# EAGLE design display_device_for_board (EAGLE 8.3.2)
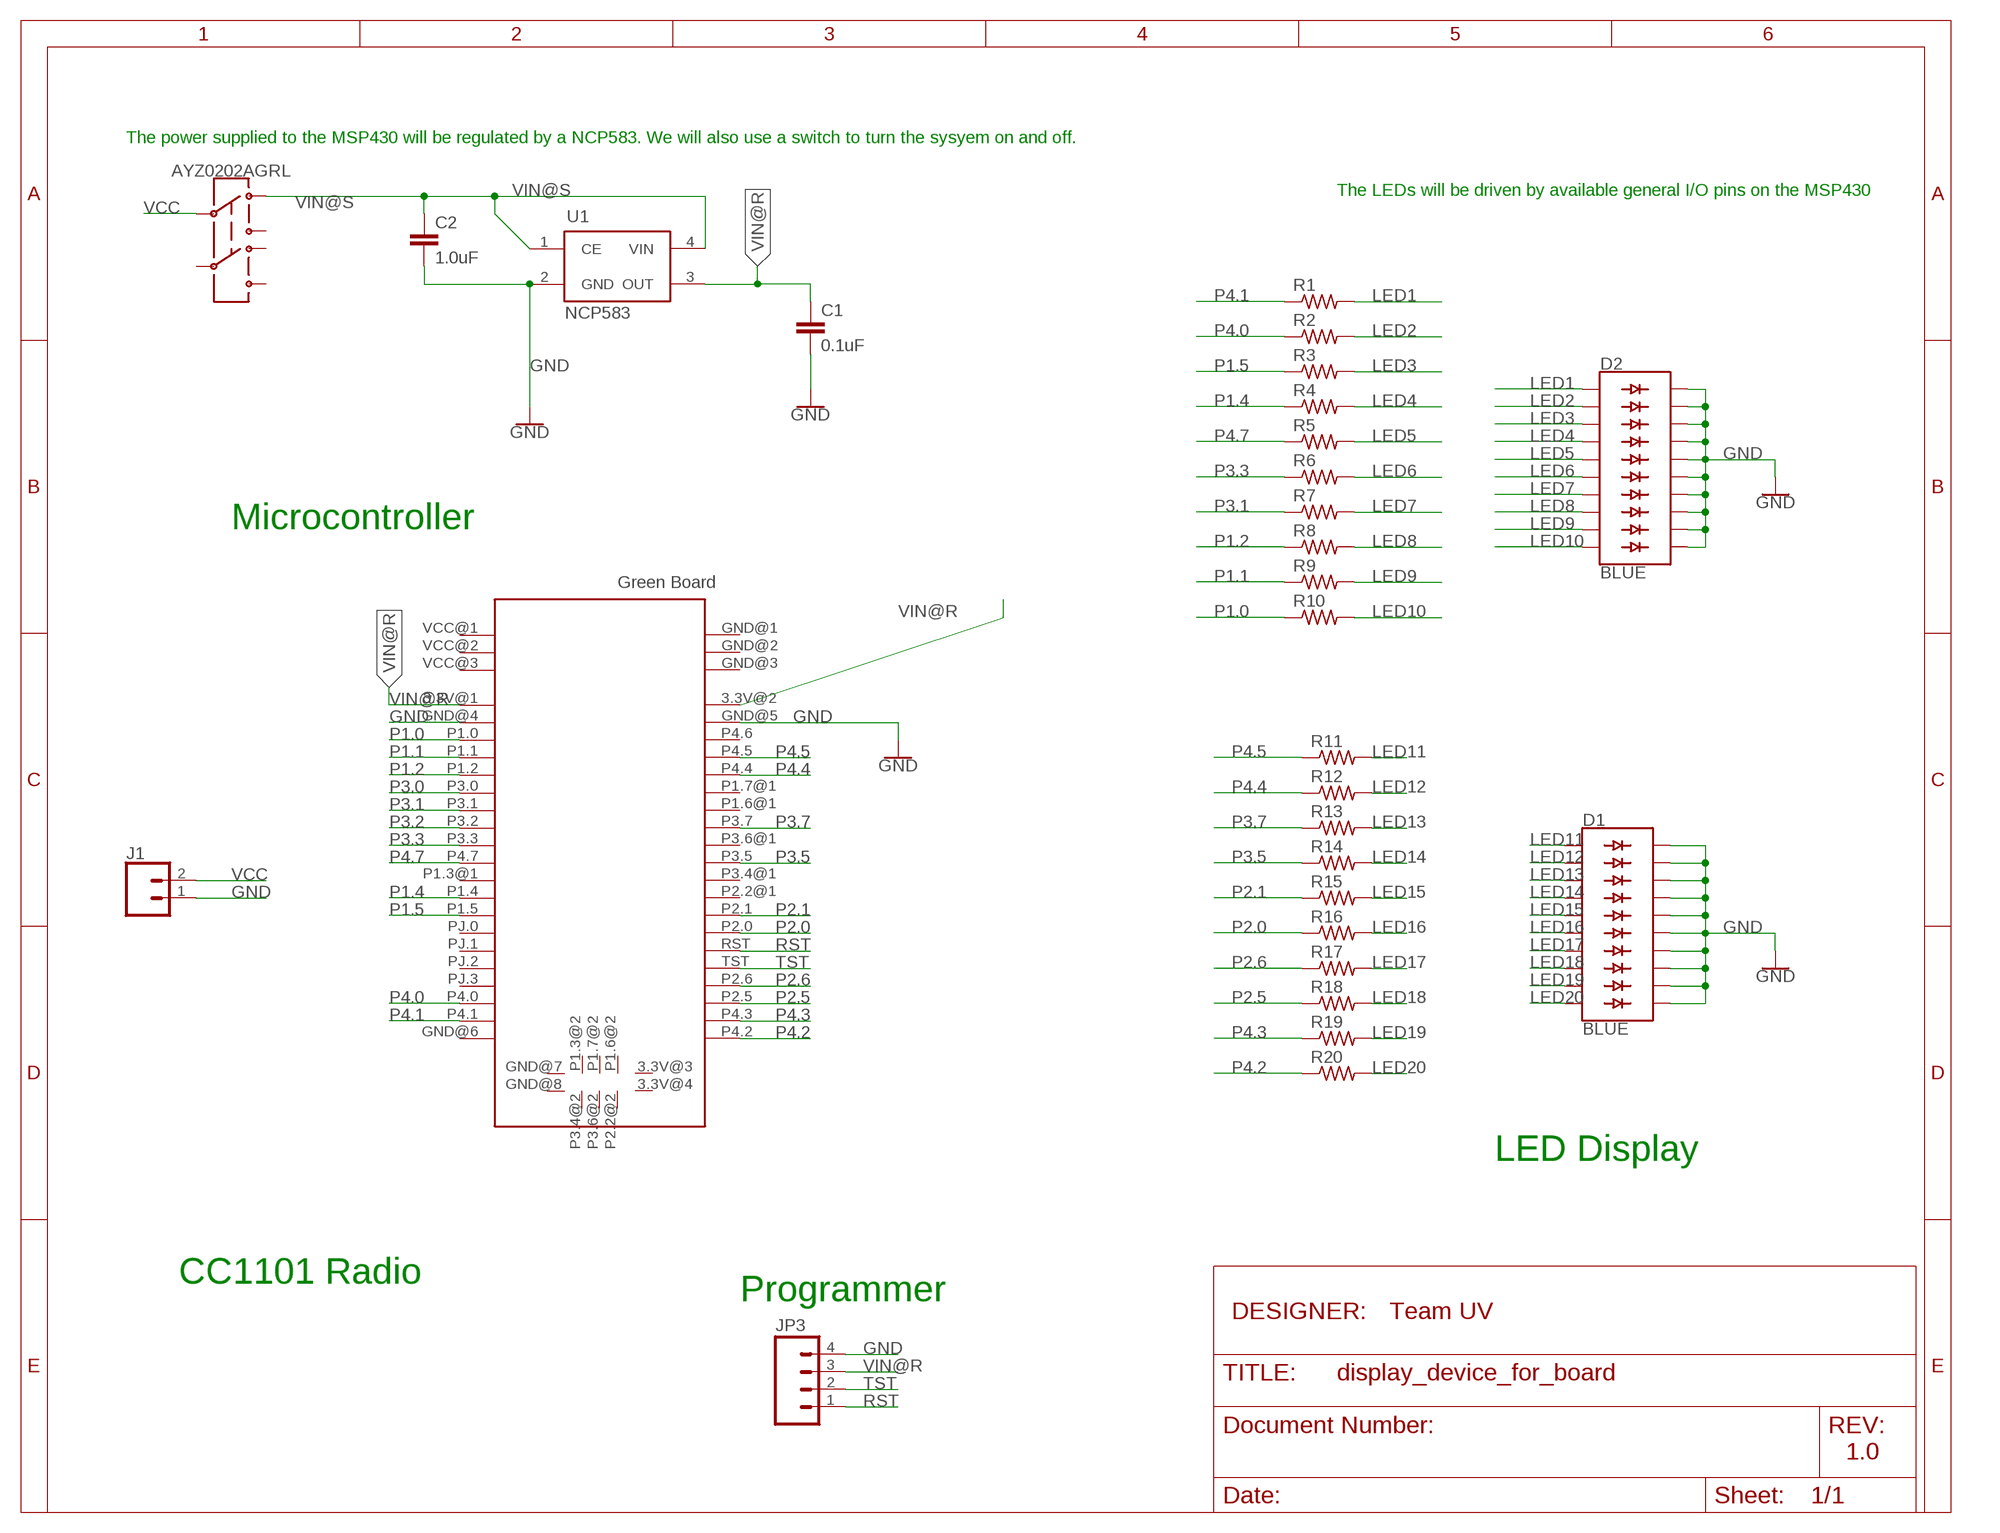
[diagram p0: schematic, sheet 1]

## Parts
AYZ0202AGRL  SWITCH-DPDT-SMD-AYZ0202  [SWITCH_DPDT_SMD_AYZ0202]
C1  0.1uF  1.0UF-0805-25V-(+80/-20%)  [0805]
C2  1.0uF  1.0UF-0805-25V-(+80/-20%)  [0805]
D1  BLUE  LED_BARGRAPH_10BLUE  [LED_BARGRAPH_10]
D2  BLUE  LED_BARGRAPH_10BLUE  [LED_BARGRAPH_10]
J1  CONN_02  [1X02]
JP3  M04PTH  [1X04]
R1  R-US_R0805  [R0805]
R2  R-US_R0805  [R0805]
R3  R-US_R0805  [R0805]
R4  R-US_R0805  [R0805]
R5  R-US_R0805  [R0805]
R6  R-US_R0805  [R0805]
R7  R-US_R0805  [R0805]
R8  R-US_R0805  [R0805]
R9  R-US_R0805  [R0805]
R10  R-US_R0805  [R0805]
R11  R-US_R0805  [R0805]
R12  R-US_R0805  [R0805]
R13  R-US_R0805  [R0805]
R14  R-US_R0805  [R0805]
R15  R-US_R0805  [R0805]
R16  R-US_R0805  [R0805]
R17  R-US_R0805  [R0805]
R18  R-US_R0805  [R0805]
R19  R-US_R0805  [R0805]
R20  R-US_R0805  [R0805]
U1  NCP583  [SC82-AB_1PRIMARY]
U$1  GREEDNBRD  [GREENBRD]

## Nets
GND: C1.2 C2.2 D1.11(C9) D1.12(C8) D1.13(C7) D1.14(C6) D1.15(C5) D1.16(C4) D1.17(C3) D1.18(C2) D1.19(C1) D1.20(C) D2.11(C9) D2.12(C8) D2.13(C7) D2.14(C6) D2.15(C5) D2.16(C4) D2.17(C3) D2.18(C2) D2.19(C1) D2.20(C) J1.1 JP3.4 U1.2(GND) U$1.GND@4(GND) U$1.GND@5(GND)
LED1: D2.1(A) R1.2
LED2: D2.2(A1) R2.2
LED3: D2.3(A2) R3.2
LED4: D2.4(A3) R4.2
LED5: D2.5(A4) R5.2
LED6: D2.6(A5) R6.2
LED7: D2.7(A6) R7.2
LED8: D2.8(A7) R8.2
LED9: D2.9(A8) R9.2
LED10: D2.10(A9) R10.2
LED11: D1.1(A) R11.2
LED12: D1.2(A1) R12.2
LED13: D1.3(A2) R13.2
LED14: D1.4(A3) R14.2
LED15: D1.5(A4) R15.2
LED16: D1.6(A5) R16.2
LED17: D1.7(A6) R17.2
LED18: D1.8(A7) R18.2
LED19: D1.9(A8) R19.2
LED20: D1.10(A9) R20.2
P1.0: R10.1 U$1.P1.0
P1.1: R9.1 U$1.P1.1
P1.2: R8.1 U$1.P1.2
P1.4: R4.1 U$1.P1.4
P1.5: R3.1 U$1.P1.5
P2.0: R16.1 U$1.P2.0
P2.1: R15.1 U$1.P2.1
P2.5: R18.1 U$1.P2.5
P2.6: R17.1 U$1.P2.6
P3.0: U$1.P3.0
P3.1: R7.1 U$1.P3.1
P3.2: U$1.P3.2
P3.3: R6.1 U$1.P3.3
P3.5: R14.1 U$1.P3.5
P3.7: R13.1 U$1.P3.7
P4.0: R2.1 U$1.P4.0
P4.1: R1.1 U$1.P4.1
P4.2: R20.1 U$1.P4.2
P4.3: R19.1 U$1.P4.3
P4.4: R12.1 U$1.P4.4
P4.5: R11.1 U$1.P4.5
P4.7: R5.1 U$1.P4.7
RST: JP3.1 U$1.RST
TST: JP3.2 U$1.TST
VCC: AYZ0202AGRL.2 J1.2
VIN@R: C1.1 JP3.3 U1.3(OUT) U$1.3.3V@1(3.3V) U$1.3.3V@2(3.3V)
VIN@S: AYZ0202AGRL.1 C2.1 U1.1(CE) U1.4(VIN)
Unconnected: AYZ0202AGRL.3 AYZ0202AGRL.4 AYZ0202AGRL.5 AYZ0202AGRL.6 U$1.3.3V@3(3.3V) U$1.3.3V@4(3.3V) U$1.GND@1(GND) U$1.GND@2(GND) U$1.GND@3(GND) U$1.GND@6(GND) U$1.GND@7(GND) U$1.GND@8(GND) U$1.P1.3@1(P1.3) U$1.P1.3@2(P1.3) U$1.P1.6@1(P1.6) U$1.P1.6@2(P1.6) U$1.P1.7@1(P1.7) U$1.P1.7@2(P1.7) U$1.P2.2@1(P2.2) U$1.P2.2@2(P2.2) U$1.P3.4@1(P3.4) U$1.P3.4@2(P3.4) U$1.P3.6@1(P3.6) U$1.P3.6@2(P3.6) U$1.P4.6 U$1.PJ.0 U$1.PJ.1 U$1.PJ.2 U$1.PJ.3 U$1.VCC@1(VCC) U$1.VCC@2(VCC) U$1.VCC@3(VCC)

## Notes on the sheet
- The power supplied to the MSP430 will be regulated by a NCP583. We will also use a switch to turn the sysyem on and off.
- The LEDs will be driven by available general I/O pins on the MSP430
- Microcontroller
- LED Display
- CC1101 Radio
- Programmer
- DESIGNER: | Team UV
- 1.0

## Library data of the parts
AYZ0202AGRL = SparkFun-Switches:SWITCH-DPDT: Double-Pole, Double-Throw (DPDT) Switch Double-pole, double-throw switches. Variant Overview PTH-GPI-152-3013 Used on SparkFun Geiger Counter <https://www.sparkfun.com/products/11345> SMD-AY0202 Surface Mount DPDT Switch <https://www.sparkfun.com/products/597> (COM-00597) Used on e.g. LilyPad Arduino USB - ATmega32U4 Board <https://www.sparkfun.com/products/12049>; PROD_ID: SWCH-08179; SF_SKU: COM-00597
C1 = SparkFun-Capacitors:1.0UF: 1µF ceramic capacitors A capacitor is a passive two-terminal electrical component used to store electrical energy temporarily in an electric field.; PROD_ID: CAP-11625; VALUE: 1.0uF
C2 = SparkFun-Capacitors:1.0UF: 1µF ceramic capacitors A capacitor is a passive two-terminal electrical component used to store electrical energy temporarily in an electric field.; PROD_ID: CAP-11625
D1 D2 = SparkFun-LED:LED_BARGRAPH_10: Young Sun LED Tech - YSLB-10251G5-10 10-Segment LED Bar Graph Features: Red Vf = 2.1V, Ifmax = 20mA Yellow Vf = 2.1V, Ifmax = 20mA Blue Vf = 3.4V, Ifmax = 20mA Green Vf = 3.4V, Ifmax = 20mA SparkFun Products: Red <https://www.sparkfun.com/products/9935> Yellow <https://www.sparkfun.com/products/9936> Green <https://www.sparkfun.com/products/9938> Blue <https://www.sparkfun.com/products/9937>; PROD_ID: DIO-10613
J1 = SparkFun-Connectors:CONN_02: Multi connection point. Often used as Generic Header-pin footprint for 0.1 inch spaced/style header connections On any of the 0.1 inch spaced packages, you can populate with these: Break Away Headers - Straight <https://www.sparkfun.com/products/116> (PRT-00116) Break Away Male Headers - Right Angle <https://www.sparkfun.com/products/553> (PRT-00553) Female Headers <https://www.sparkfun.com/products/115> (PRT-00115) Break Away Headers - Machine Pin <https://www.sparkfun.com/products/117> (PRT-00117) Break Away Female Headers - Swiss Machine Pin <https://www.sparkfun.com/products/743> (PRT-00743) For SCREWTERMINALS and SPRING TERMINALS visit here: Screw Terimnals on SparkFun.com <https://www.sparkfun.com/search/results?term=Screw+Terminals> (5mm/3.5mm/2.54mm spacing) This device is also useful as a general connection point to wire up your design to another part of your project. Our various solder wires solder well into these plated through hole pads. Hook-Up Wire - Assortment (Stranded, 22 AWG) <https://www.sparkfun.com/products/11375> (PRT-11375) Hook-Up Wire - Assortment (Solid Core, 22 AWG) <https://www.sparkfun.com/products/11367> (PRT-11367) View the entire wire category on our website here <https://www.sparkfun.com/categories/141> Special notes: Molex polarized connector foot print use with: PRT-08233 with associated crimp pins and housings. 2.54_SCREWTERM for use with PRT-10571. 3.5mm Screw Terminal footprints for PRT-08084 5mm Screw Terminal footprints for use with PRT-08432
JP3 = Moo1.2:M04: Header 4 Standard 4-pin 0.1" header. Use with straight break away headers (SKU : PRT-00116), right angle break away headers (PRT-00553), swiss pins (PRT-00743), machine pins (PRT-00117), and female headers (PRT-00115). Molex polarized connector foot print use with SKU : PRT-08231 with associated crimp pins and housings. 1MM SMD Version SKU: PRT-10208
R1-R20 = rcl:R-US_: RESISTOR, American symbol
U1 = ncp583:NCP583: NCP583 - Ultra-Low Iq 150 mA CMOS LDO Regulator with Enable The NCP583 series of low dropout regulators are designed for portable battery powered applications which require precise output voltage accuracy and low quiescent current. These devices feature an enable function which lowers current consumption significantly and are offered in two small packages; SC−82AB and the SOT−563. A 1.0 mF ceramic capacitor is the recommended value to be used with these devices on the output pin.
U$1 = GreenBoard:GREEDNBRD

## Board
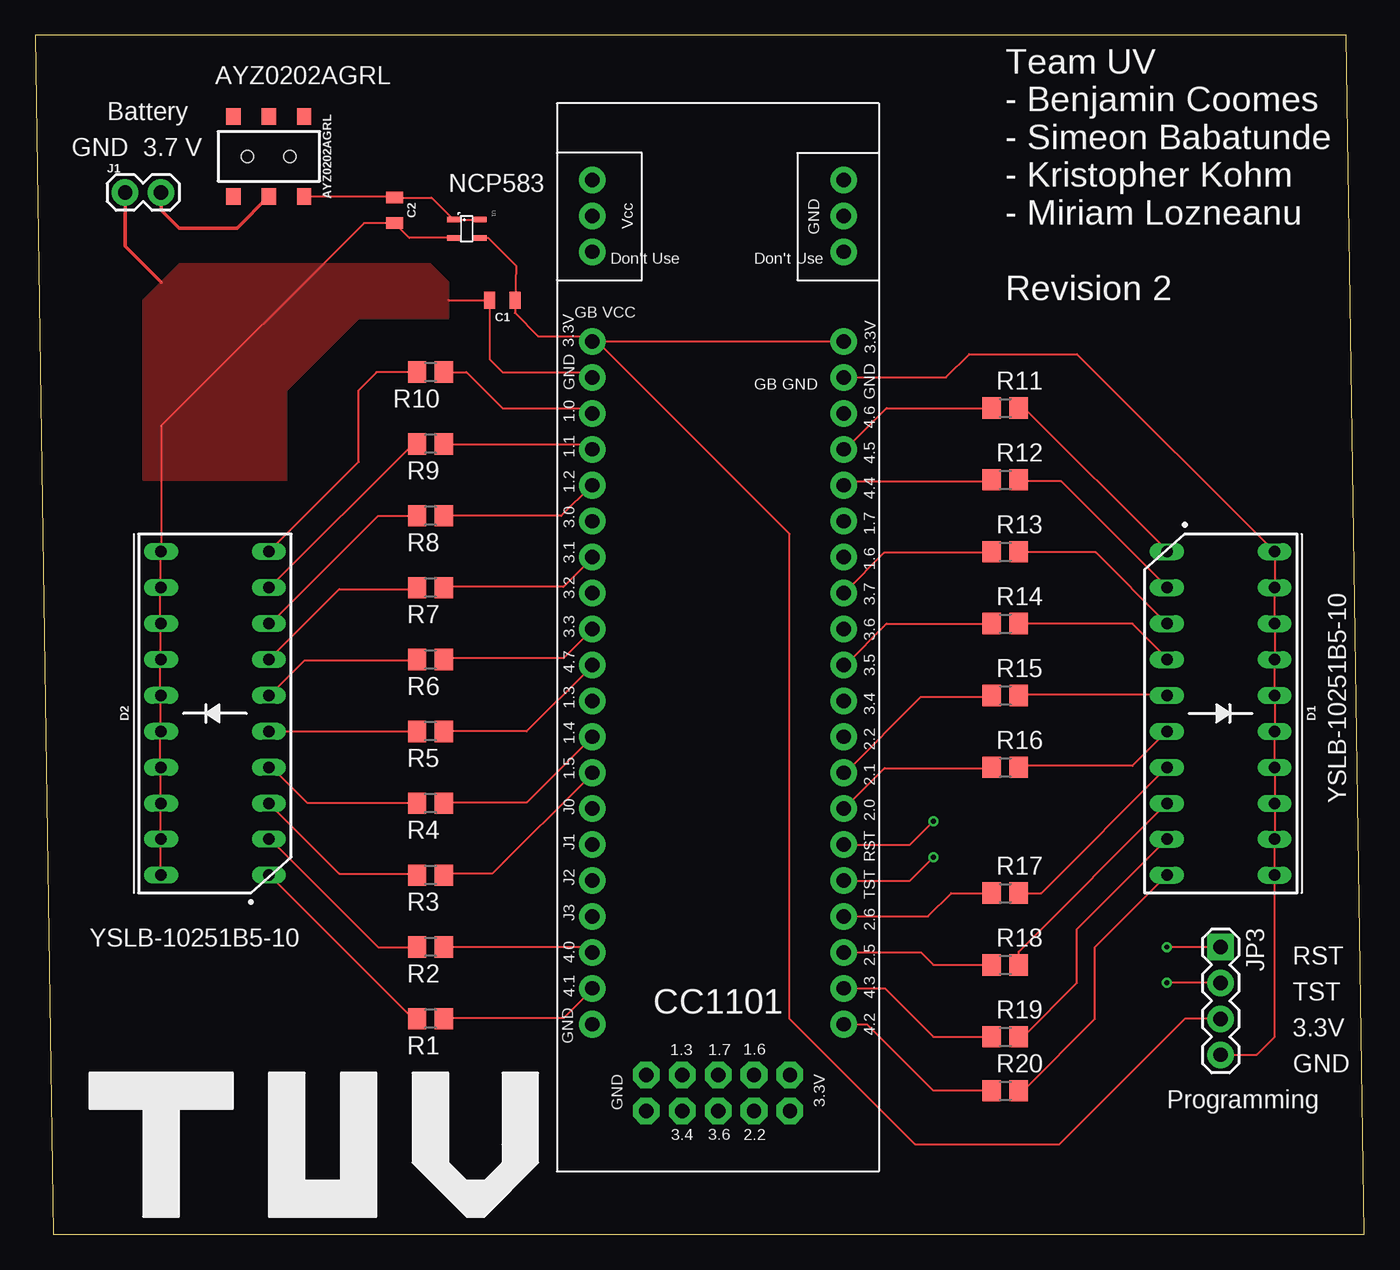
[diagram p1: board, top side]
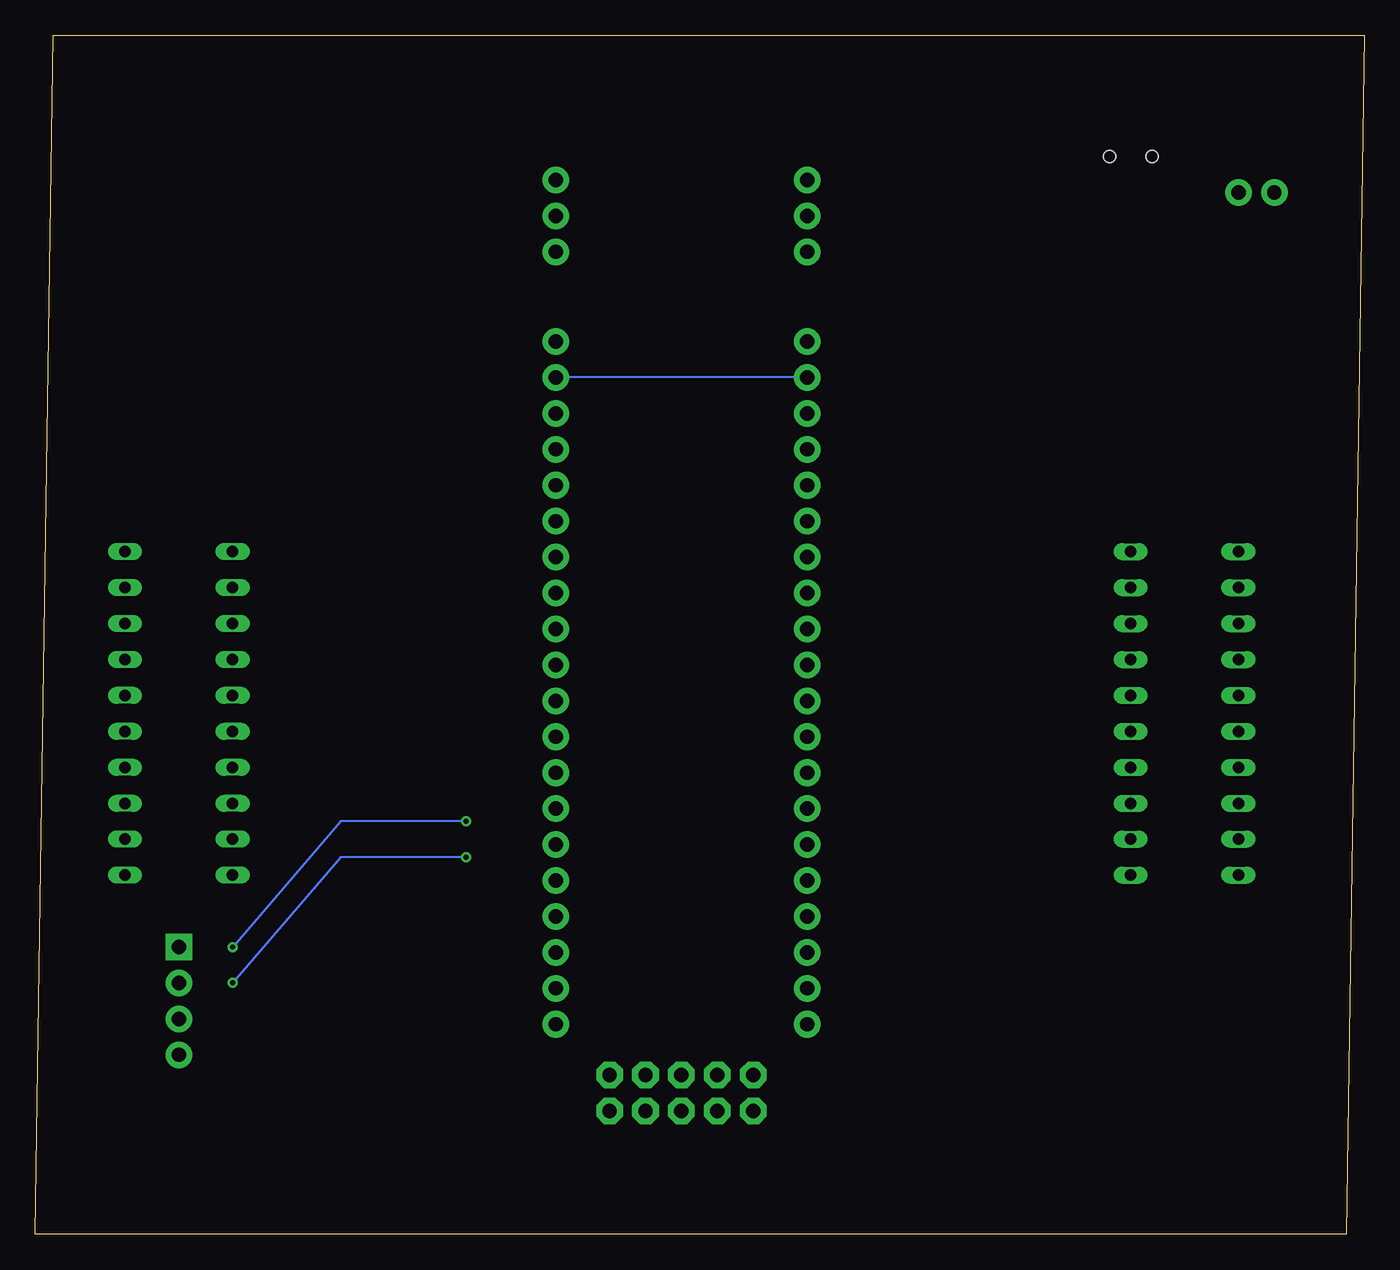
[diagram p2: board, bottom side, seen from below]

Size 93.96 x 84.76 mm. Coordinates in mm from the lower left corner, seen from the top.
Outline: 1.27,0 93.96,0 92.69,84.76 0,84.76 1.27,0
Copper layers (1*16): Top 0.0356mm / dielectric 1.5011mm / Bottom 0.0356mm
Design rules "oshpark-2layer": minimum track width 6mil, minimum drill 13mil, track to track 6mil, track to pad 6mil, pad to pad 6mil, via to via 6mil, smd to smd 6mil, copper to edge 15mil, drill to drill 6mil, minimum pad ring 7mil, minimum via ring 7mil, stop-mask expansion 2.5mil, vias tented up to drill 0mil, thermal gap 10mil

### Footprints (pad centres in the part's own frame; a part is rotated, then mirrored left to right if it is on the bottom)
SWITCH_DPDT_SMD_AYZ0202 = smd 1 x 1.15: 1 -2.5,2.825; 2 0,2.825; 3 2.5,2.825; 4 -2.5,-2.825; 5 0,-2.825; 6 2.5,-2.825 | hole 0.85: 1.5,0; -1.5,0
0805 = smd 0.8 x 1.2: 1 -0.9,0; 2 0.9,0
LED_BARGRAPH_10 = drill 0.813 long: 1 -11.43,-3.81; 2 -8.89,-3.81; 3 -6.35,-3.81; 4 -3.81,-3.81; 5 -1.27,-3.81; 6 1.27,-3.81; 7 3.81,-3.81; 8 6.35,-3.81; 9 8.89,-3.81; 10 11.43,-3.81; 11 11.43,3.81; 12 8.89,3.81; 13 6.35,3.81; 14 3.81,3.81; 15 1.27,3.81; 16 -1.27,3.81; 17 -3.81,3.81; 18 -6.35,3.81; 19 -8.89,3.81; 20 -11.43,3.81
1X02 = drill 1.016 pad 1.88: 1 0,0; 2 2.54,0
1X04 = drill 1.016 pad 1.88 square: 1 0,0 | drill 1.016 pad 1.88: 2 2.54,0; 3 5.08,0; 4 7.62,0
R0805 = smd 1.3 x 1.5: 1 -0.95,0; 2 0.95,0
SC82-AB_1PRIMARY = smd 0.406 x 0.914: 1 -0.621,-0.913; 2 0.675,-0.913; 3 0.675,0.967; 4 -0.621,0.967
GREENBRD = drill 1.015 pad 1.88: 3.3V@1 -8.875,21.21; 3.3V@2 8.905,21.21; GND@1 8.905,32.63; GND@2 8.905,30.09; GND@3 8.905,27.55; GND@4 -8.875,18.67; GND@5 8.905,18.67; GND@6 -8.875,-27.05; P1.0 -8.875,16.13; P1.1 -8.875,13.59; P1.2 -8.875,11.05; P1.3@1 -8.875,-4.19; P1.4 -8.875,-6.73; P1.5 -8.875,-9.27; P1.6@1 8.905,5.97; P1.7@1 8.905,8.51; P2.0 8.905,-11.81; P2.1 8.905,-9.27; P2.2@1 8.905,-6.73; P2.5 8.905,-21.97; P2.6 8.905,-19.43; P3.0 -8.875,8.51; P3.1 -8.875,5.97; P3.2 -8.875,3.43; P3.3 -8.875,0.89; P3.4@1 8.905,-4.19; P3.5 8.905,-1.65; P3.6@1 8.905,0.89; P3.7 8.905,3.43; P4.0 -8.875,-21.97; P4.1 -8.875,-24.51; P4.2 8.905,-27.05; P4.3 8.905,-24.51; P4.4 8.905,11.05; P4.5 8.905,13.59; P4.6 8.905,16.13; P4.7 -8.875,-1.65; PJ.0 -8.875,-11.81; PJ.1 -8.875,-14.35; PJ.2 -8.875,-16.89; PJ.3 -8.875,-19.43; RST 8.905,-14.35; TST 8.905,-16.89; VCC@1 -8.875,32.63; VCC@2 -8.875,30.09; VCC@3 -8.875,27.55 | drill 1.015 pad 1.88 octagon: 3.3V@3 5.095,-30.63; 3.3V@4 5.095,-33.17; GND@7 -5.065,-30.63; GND@8 -5.065,-33.17; P1.3@2 -2.525,-30.63; P1.6@2 2.555,-30.63; P1.7@2 0.015,-30.63; P2.2@2 2.555,-33.17; P3.4@2 -2.525,-33.17; P3.6@2 0.015,-33.17

### Placement (x,y rotation side)
AYZ0202AGRL  16.51,76.2 180 top
C1  33.02,66.04 180 top
C2  25.4,72.39 270 top
D1  83.82,36.83 270 top
D2  12.7,36.83 90 top
J1  6.35,73.66 0 top
JP3  83.82,20.32 270 top
R1  27.94,15.24 180 top
R2  27.94,20.32 180 top
R3  27.94,25.4 180 top
R4  27.94,30.48 180 top
R5  27.94,35.56 180 top
R6  27.94,40.64 180 top
R7  27.94,45.72 180 top
R8  27.94,50.8 180 top
R9  27.94,55.88 180 top
R10  27.94,60.96 180 top
R11  68.58,58.42 0 top
R12  68.58,53.34 0 top
R13  68.58,48.26 0 top
R14  68.58,43.18 0 top
R15  68.58,38.1 0 top
R16  68.58,33.02 0 top
R17  68.58,24.13 0 top
R18  68.58,19.05 0 top
R19  68.58,13.97 0 top
R20  68.58,10.16 0 top
U1  30.48,71.12 270 top
U$1  48.26,41.91 0 top

### Tracks (layer width: path | path; a pad name or v marks a point on that pad's centre or on a via)
GND
  Top 0.152: D1.20 D1.19 D1.18 D1.17 D1.16 D1.15 D1.14 D1.13 D1.12 D1.11 87.63,13.97 86.36,12.7 JP3.4 | 8.84,43.18 8.84,40.74 D2.14 8.84,40.59 8.84,38.15 D2.15 8.84,38 8.84,35.56 | 8.84,27.94 8.84,25.5 D2.20 | 8.84,27.94 8.84,30.38 D2.18 8.84,30.53 8.84,32.97 D2.17 8.84,33.12 8.84,35.56 | 8.84,27.94 D2.19 | 8.84,35.56 D2.16 | 8.84,43.18 8.84,45.62 D2.12 8.84,45.77 8.84,48.21 D2.11 8.89,57.15 23.23,71.49 C2.2 | 8.84,43.18 D2.13 | 57.15,60.55 U$1.GND@5 64.39,60.58 66.04,62.23 73.66,62.23 D1.20 | 39.47,60.55 U$1.GND@4 39,60.96 33.02,60.96 32.12,61.86 C1.2 29.21,66.04 | 25.3,71.37 C2.2 | 87.63,48.36 D1.20 | U1.2 26.44,70.44 C2.2
  Top 0.254: J1.1 6.35,69.85 8.89,67.31
  Bottom 0.152: U$1.GND@4 U$1.GND@5
  pour Top: 7.62,53.34 17.78,53.34 17.78,59.69 22.86,64.77 29.21,64.77 29.21,67.31 27.94,68.58 10.16,68.58 7.62,66.04
LED1
  Top 0.152: R1.2 26.97,15.29 26.67,15.29 16.61,25.35 D2.1
LED2
  Top 0.152: R2.2 24.23,20.32 16.61,27.94 D2.2
LED3
  Top 0.152: D2.3 21.49,25.5 26.97,25.5 R3.2
LED4
  Top 0.152: R4.2 26.97,30.53 19.2,30.53 16.61,33.12 D2.4
LED5
  Top 0.152: D2.5 R5.2
LED6
  Top 0.152: R6.2 26.97,40.59 19.05,40.59 16.61,38.15 D2.6
LED7
  Top 0.152: D2.7 21.49,45.62 26.97,45.62 R7.2
LED8
  Top 0.152: R8.2 24.23,50.8 16.61,43.18 D2.8
LED9
  Top 0.152: R9.2 26.97,55.83 26.67,55.83 16.61,45.77 D2.9
LED10
  Top 0.152: 26.97,60.86 R10.2 24.13,60.96 22.86,59.69 22.86,54.61 D2.10
LED11
  Top 0.152: R11.2 69.95,58.42 80.01,48.36 D1.1
LED12
  Top 0.152: R12.2 69.65,53.24 72.54,53.24 80.01,45.77 D1.2
LED13
  Top 0.152: D1.3 74.98,48.21 69.65,48.21 R13.2
LED14
  Top 0.152: R14.2 77.57,43.18 80.01,40.74 D1.4
LED15
  Top 0.152: R15.2 69.65,38.15 80.01,38.15 D1.5
LED16
  Top 0.152: D1.6 77.57,33.12 69.65,33.12 R16.2
LED17
  Top 0.152: R17.2 71.12,24.13 D1.7
LED18
  Top 0.152: R18.2 69.53,20 D1.8
LED19
  Top 0.152: D1.9 73.66,21.59 73.66,17.78 69.85,13.97 R19.2
LED20
  Top 0.152: 80.01,25.35 D1.10 74.93,20.32 74.93,15.24 69.85,10.16 R20.2
P1.0
  Top 0.152: 28.96,60.86 R10.1 30.48,60.96 33.02,58.42 39.01,58.42 39.32,58.11 U$1.P1.0
P1.1
  Top 0.152: R9.1 28.96,55.83 39.01,55.83 39.32,55.52 U$1.P1.1
P1.2
  Top 0.152: R8.1 37.19,50.8 39.32,52.93 U$1.P1.2
P1.4
  Top 0.152: R4.1 28.96,30.53 34.75,30.53 39.32,35.1 U$1.P1.4
P1.5
  Top 0.152: R3.1 28.96,25.5 32.31,25.5 39.32,32.51 U$1.P1.5
P2.0
  Top 0.152: R16.1 67.51,32.97 60.05,32.97 57.3,30.23 U$1.P2.0
P2.1
  Top 0.152: R15.1 67.51,38 62.64,38 57.3,32.66 U$1.P2.1
P2.5
  Top 0.152: U$1.P2.5 62.61,19.94 63.5,19.05 R18.1
P2.6
  Top 0.152: U$1.P2.6 63.12,22.48 64.77,24.13 R17.1
P3.1
  Top 0.152: R7.1 28.96,45.77 37.34,45.77 39.32,47.75 U$1.P3.1
P3.3
  Top 0.152: R6.1 28.96,40.74 37.34,40.74 39.32,42.72 U$1.P3.3
P3.5
  Top 0.152: R14.1 60.2,43.18 57.3,40.28 U$1.P3.5
P3.7
  Top 0.152: R13.1 67.51,48.21 60.05,48.21 57.3,45.47 U$1.P3.7
P4.0
  Top 0.152: R2.1 39.01,20.32 39.32,20.01 U$1.P4.0
P4.1
  Top 0.152: R1.1 28.96,15.29 37.34,15.29 39.32,17.27 U$1.P4.1
P4.2
  Top 0.152: U$1.P4.2 58.8,14.86 63.5,10.16 R20.1
P4.3
  Top 0.152: U$1.P4.3 60.07,17.4 63.5,13.97 R19.1
P4.4
  Top 0.152: R12.1 67.51,53.24 57.45,53.24 57.3,53.09 U$1.P4.4
P4.5
  Top 0.152: R11.1 60.2,58.42 57.3,55.52 U$1.P4.5
P4.7
  Top 0.152: R5.1 34.75,35.56 39.32,40.13 U$1.P4.7
RST  (via drill 0.35)
  Top 0.152: JP3.1 v80.01,20.32 | U$1.RST 61.85,27.56 v63.5,29.21
  Bottom 0.152: v63.5,29.21 72.39,29.21 v80.01,20.32
TST  (via drill 0.35)
  Top 0.152: U$1.TST 61.85,25.02 v63.5,26.67 | JP3.2 v80.01,17.78
  Bottom 0.152: v63.5,26.67 72.39,26.67 v80.01,17.78
VCC
  Top 0.254: J1.2 8.89,72.39 10.16,71.12 14.25,71.12 AYZ0202AGRL.2
VIN@R
  Top 0.152: U$1.3.3V@1 39.32,63.14 38.96,63.5 35.56,63.5 33.92,65.14 C1.1 33.98,68.48 32.02,70.44 U1.3 | U$1.3.3V@2 57.15,63.14 39.47,63.14 U$1.3.3V@1 | JP3.3 81.28,15.24 72.39,6.35 62.23,6.35 53.34,15.24 53.34,49.53 39.75,63.12 U$1.3.3V@1
VIN@S
  Top 0.152: 25.3,73.35 C2.1 | 25.45,73.35 C2.1 | U1.4 U1.1 28.02,73.29 C2.1 | 25.4,73.46 25.3,73.35 | AYZ0202AGRL.1 25.28,73.38 25.3,73.35
  Top 0.254: 25.43,73.38 25.45,73.35

### Text on the board
tPlace: 3.7 V
tNames: AYZ0202AGRL | Battery | GND | NCP583 | Don't Use | Don't Use | Team UV / - Benjamin Coomes / - Simeon Babatunde / - Kristopher Kohm / - Miriam Lozneanu / / Revision 2 | GB VCC | GB GND | YSLB-10251B5-10 | YSLB-10251B5-10 | RST | TST | 3.3V | GND | Programming